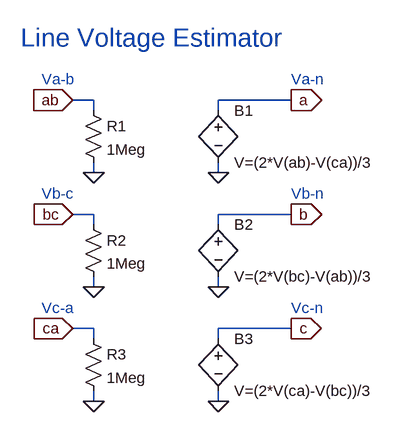
[diagram p0: schematic LINEVOLT.asc]
LINEVOLT.asc, the LTspice schematic file:
Version 4
SHEET 1 880 680
WIRE 32 80 0 80
WIRE 336 80 224 80
WIRE 32 96 32 80
WIRE 224 96 224 80
WIRE 32 192 32 176
WIRE 224 192 224 176
WIRE 32 256 0 256
WIRE 336 256 224 256
WIRE 32 272 32 256
WIRE 224 272 224 256
WIRE 32 368 32 352
WIRE 224 368 224 352
WIRE 32 432 0 432
WIRE 336 432 224 432
WIRE 32 448 32 432
WIRE 224 448 224 432
WIRE 32 544 32 528
WIRE 224 544 224 528
FLAG 0 80 ab
IOPIN 0 80 In
FLAG 0 256 bc
IOPIN 0 256 In
FLAG 0 432 ca
IOPIN 0 432 In
FLAG 224 192 0
FLAG 336 80 a
IOPIN 336 80 Out
FLAG 224 368 0
FLAG 336 256 b
IOPIN 336 256 Out
FLAG 224 544 0
FLAG 336 432 c
IOPIN 336 432 Out
FLAG 32 192 0
FLAG 32 368 0
FLAG 32 544 0
SYMBOL bv 224 80 R0
SYMATTR InstName B1
SYMATTR Value V=(2*V(ab)-V(ca))/3
SYMBOL bv 224 256 R0
SYMATTR InstName B2
SYMATTR Value V=(2*V(bc)-V(ab))/3
SYMBOL bv 224 432 R0
SYMATTR InstName B3
SYMATTR Value V=(2*V(ca)-V(bc))/3
SYMBOL res 16 80 R0
SYMATTR InstName R1
SYMATTR Value 1Meg
SYMBOL res 16 256 R0
SYMATTR InstName R2
SYMATTR Value 1Meg
SYMBOL res 16 432 R0
SYMATTR InstName R3
SYMATTR Value 1Meg
TEXT -80 -16 Left 4 ;Line Voltage Estimator
TEXT -48 48 Left 2 ;Va-b
TEXT -48 224 Left 2 ;Vb-c
TEXT -48 400 Left 2 ;Vc-a
TEXT 336 48 Left 2 ;Va-n
TEXT 336 224 Left 2 ;Vb-n
TEXT 336 400 Left 2 ;Vc-n

The netlist it stands for:
* LINEVOLT.asc
B1 a 0 V=(2*V(ab)-V(ca))/3
B2 b 0 V=(2*V(bc)-V(ab))/3
B3 c 0 V=(2*V(ca)-V(bc))/3
R1 ab 0 1Meg
R2 bc 0 1Meg
R3 ca 0 1Meg
* Line Voltage Estimator
* Va-b
* Vb-c
* Vc-a
* Va-n
* Vb-n
* Vc-n
.backanno
.end